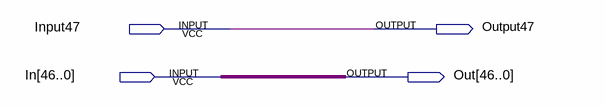
[diagram p0: schematic sheet]
// Quartus schematic ConvertBus48bit.bdf as structural Verilog: 0 symbols, 4 pins
module ConvertBus48bit (
  input  Input47,
  input  [46:0] In,
  output Output47,
  output [46:0] Out
);


  assign Out = In;
  assign Output47 = Input47;
endmodule
